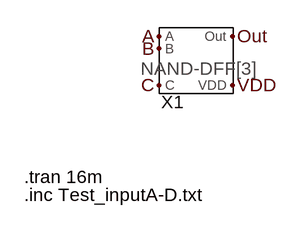
[diagram p0: schematic Test_NAND_DFF[3].asc]
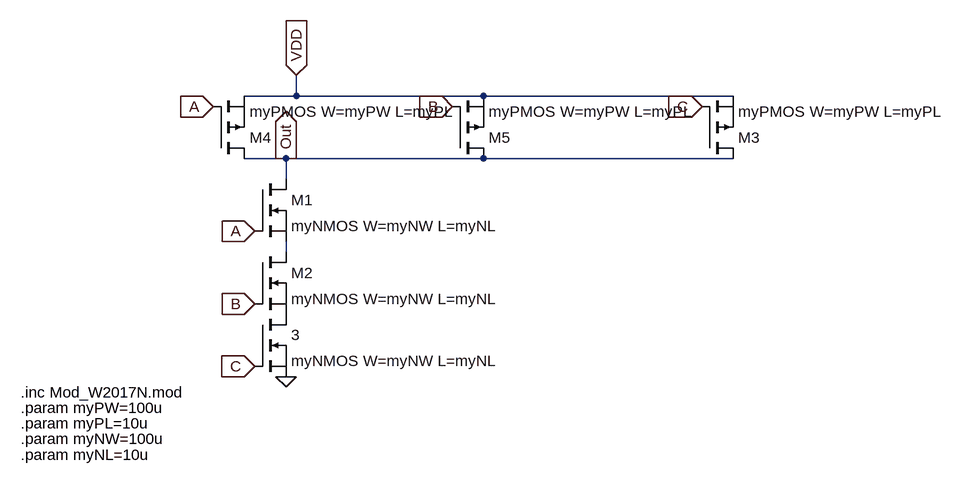
[diagram p1: sub-circuit gate_nand_dff[3].asc]
Test_NAND_DFF[3].asc, the LTspice schematic file:
Version 4
SHEET 1 880 680
FLAG 224 112 Out
FLAG 128 112 A
FLAG 128 176 C
FLAG 224 176 VDD
FLAG 128 128 B
SYMBOL Gate_NAND_DFF[3] 176 144 R0
SYMATTR InstName X1
TEXT -48 296 Left 2 !.tran 16m
TEXT -48 320 Left 2 !.inc Test_inputA-D.txt

gate_nand_dff[3].asc, the sub-circuit schematic file:
Version 4
SHEET 1 1256 680
WIRE 64 -112 64 -144
WIRE 64 -112 -16 -112
WIRE 352 -112 64 -112
WIRE 736 -112 352 -112
WIRE 48 -16 -16 -16
WIRE 352 -16 48 -16
WIRE 736 -16 352 -16
WIRE 48 16 48 -16
WIRE 48 128 48 112
FLAG 48 320 0
FLAG 0 208 B
IOPIN 0 208 In
FLAG 48 -16 Out
IOPIN 48 -16 Out
FLAG 64 -144 VDD
IOPIN 64 -144 In
FLAG 304 -96 B
IOPIN 304 -96 In
FLAG -64 -96 A
IOPIN -64 -96 In
FLAG 0 96 A
IOPIN 0 96 In
FLAG 0 304 C
IOPIN 0 304 In
FLAG 688 -96 C
IOPIN 688 -96 In
SYMBOL nmos 0 16 R0
SYMATTR InstName M1
SYMATTR Value myNMOS W=myNW L=myNL
SYMBOL pmos -64 -16 M180
SYMATTR InstName M4
SYMATTR Value myPMOS W=myPW L=myPL
SYMBOL pmos 304 -16 M180
SYMATTR InstName M5
SYMATTR Value myPMOS W=myPW L=myPL
SYMBOL nmos 0 128 R0
SYMATTR InstName M2
SYMATTR Value myNMOS W=myNW L=myNL
SYMBOL nmos 0 224 R0
SYMATTR InstName 3
SYMATTR Value myNMOS W=myNW L=myNL
SYMBOL pmos 688 -16 M180
SYMATTR InstName M3
SYMATTR Value myPMOS W=myPW L=myPL
TEXT -360 344 Left 2 !.inc Mod_W2017N.mod
TEXT -360 368 Left 2 !.param myPW=100u
TEXT -360 392 Left 2 !.param myPL=10u
TEXT -360 416 Left 2 !.param myNW=100u
TEXT -360 440 Left 2 !.param myNL=10u

The netlist it stands for:
* Test_NAND_DFF[3].asc
XX1 A C Out VDD B gate_nand_dff[3]

* block symbol definitions
.subckt gate_nand_dff[3] A C Out VDD B
M1 Out A N001 N001 myNMOS W=myNW L=myNL
M4 Out A VDD VDD myPMOS W=myPW L=myPL
M5 Out B VDD VDD myPMOS W=myPW L=myPL
M2 N001 B P001 P001 myNMOS W=myNW L=myNL
M§3 P001 C 0 0 myNMOS W=myNW L=myNL
M3 Out C VDD VDD myPMOS W=myPW L=myPL
.inc Mod_W2017N.mod
.param myPW=100u
.param myPL=10u
.param myNW=100u
.param myNL=10u
.ends gate_nand_dff[3]

.model NMOS NMOS
.model PMOS PMOS
.lib standard.mos
.tran 16m
.inc Test_inputA-D.txt
.backanno
.end